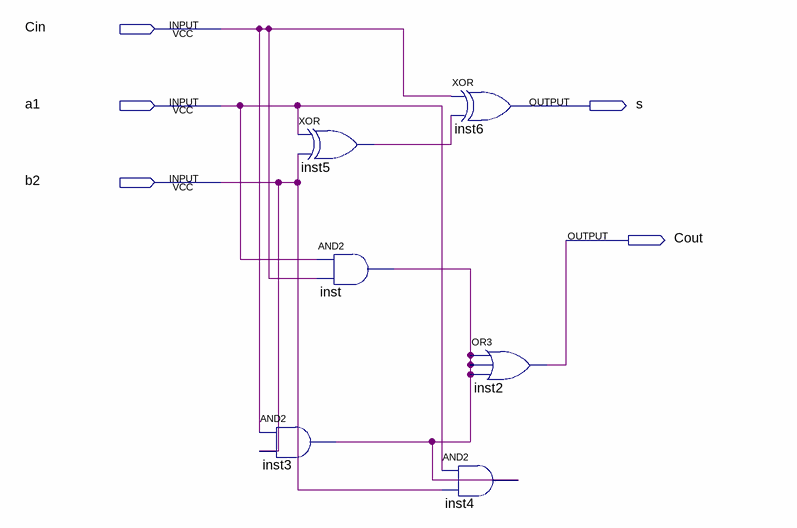
[diagram p0: schematic sheet]
// Quartus schematic lab3.bdf as structural Verilog: 6 symbols, 5 pins
module lab3 (
  input  Cin,
  input  a1,
  input  b2,
  output s,
  output Cout
);

  wire inst5_out, inst_out;

  xor inst5 (inst5_out, a1, b2);
  and inst (inst_out, a1, Cin);
  and inst3 (inst_out, Cin, b2);
  xor inst6 (s, Cin, inst5_out);
  or inst2 (Cout, inst_out, inst_out, inst_out);
  and inst4 (inst_out, a1, b2);
endmodule
